# EAGLE design Base_board_V1 (EAGLE 9.6.2)
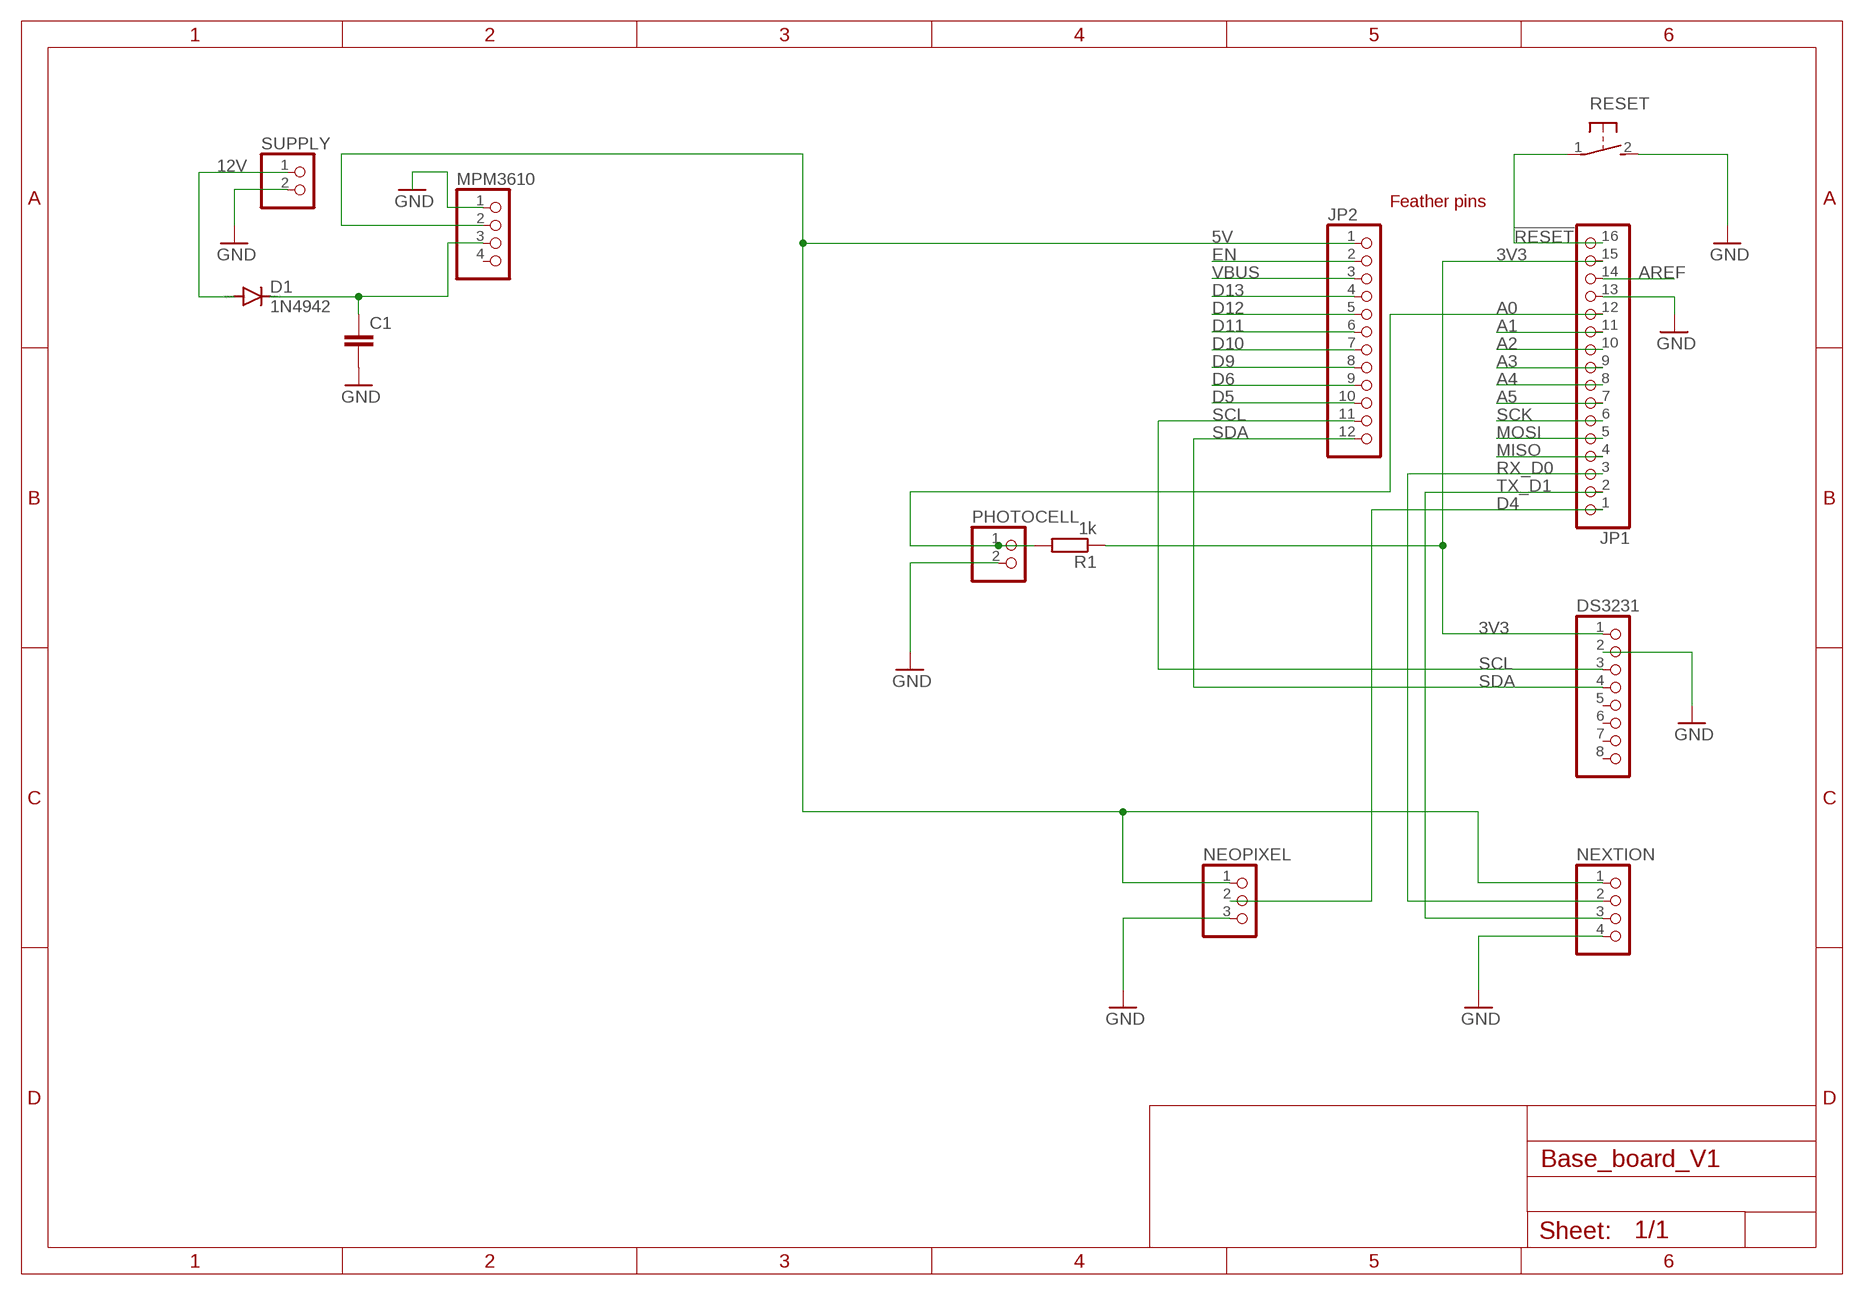
[diagram p0: schematic, sheet 1]

## Parts
C1  C2,5-3  [C2.5-3]
D1  1N4942  [DO41-10]
DS3231  HEADER-1X870MIL  [1X08_ROUND_70]
JP1  HEADER-1X16ROUND  [1X16_ROUND]
JP2  HEADER-1X12  [1X12_ROUND]
MPM3610  PINHD-1X4  [1X04]
NEOPIXEL  PINHD-1X3/90  [1X03/90]
NEXTION  PINHD-1X4  [1X04]
PHOTOCELL  PINHD-1X2/90  [1X02/90]
R1  1k  R-EU_0207/10  [0207/10]
RESET  31-XX  [B3F-31XX]
SUPPLY  PINHD-1X2  [1X02]

## Nets
3V3 [power]: DS3231.1 JP1.15 R1.1
5V: JP2.1 MPM3610.2 NEOPIXEL.1 NEXTION.1
12V: D1.A SUPPLY.1
!RESET: JP1.16 RESET.1(P)
A0: JP1.12 PHOTOCELL.1 R1.2
A1: JP1.11
A2: JP1.10
A3: JP1.9
A4: JP1.8
A5: JP1.7
AREF: JP1.14
D4: JP1.1 NEOPIXEL.2
D5: JP2.10
D6: JP2.9
D9: JP2.8
D10: JP2.7
D11: JP2.6
D12: JP2.5
D13: JP2.4
EN: JP2.2
GND [power]: C1.2 DS3231.2 JP1.13 MPM3610.1 NEOPIXEL.3 NEXTION.4 PHOTOCELL.2 RESET.2(S) SUPPLY.2
MISO: JP1.4
MOSI: JP1.5
N$1: C1.1 D1.C MPM3610.3
RX_D0: JP1.3 NEXTION.2
SCK: JP1.6
SCL: DS3231.3 JP2.11
SDA: DS3231.4 JP2.12
TX_D1: JP1.2 NEXTION.3
VBUS [power]: JP2.3
Unconnected: DS3231.5 DS3231.6 DS3231.7 DS3231.8 MPM3610.4

## Notes on the sheet
- Feather pins

## Library data of the parts
C1 = capacitor-wima:C: CAPACITOR naming: grid - package width
D1 = diode:1N4942: DIODE 1.0 A, 200 V, 150 ns
DS3231 = microbuilder:HEADER-1X8: PIN HEADER
JP1 = microbuilder:HEADER-1X16: PIN HEADER
JP2 = microbuilder:HEADER-1X12
MPM3610 NEXTION = pinhead:PINHD-1X4: PIN HEADER
NEOPIXEL = pinhead:PINHD-1X3: PIN HEADER
PHOTOCELL SUPPLY = pinhead:PINHD-1X2: PIN HEADER
R1 = rcl:R-EU_: RESISTOR, European symbol; SPICEPREFIX: R
RESET = switch-omron:31-XX: OMRON SWITCH; MPN: B3F-3100; OC_FARNELL: 959704; OC_NEWARK: 36M3582

## Net classes
1 power: width 0.305 mm

## Board
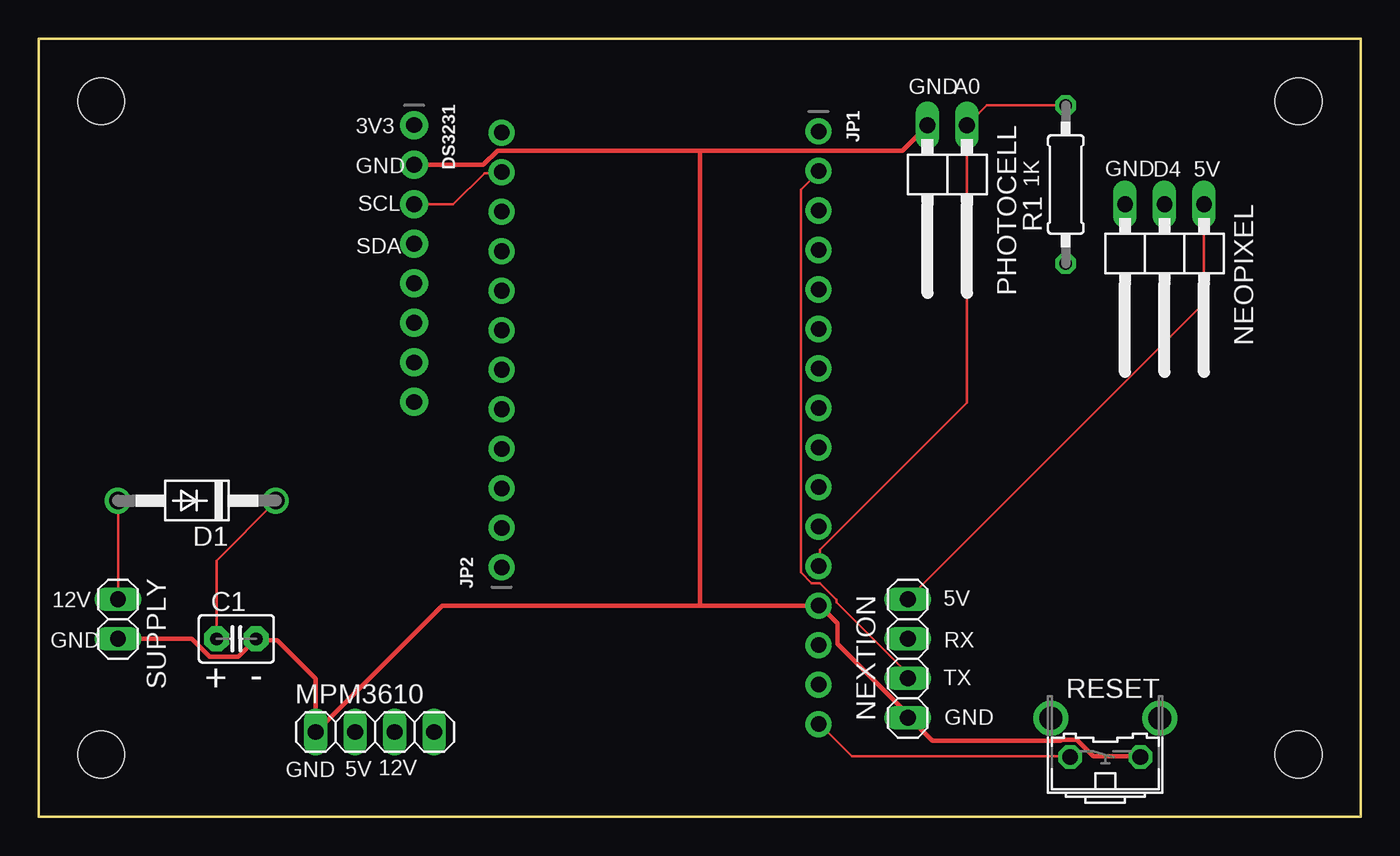
[diagram p1: board, top side]
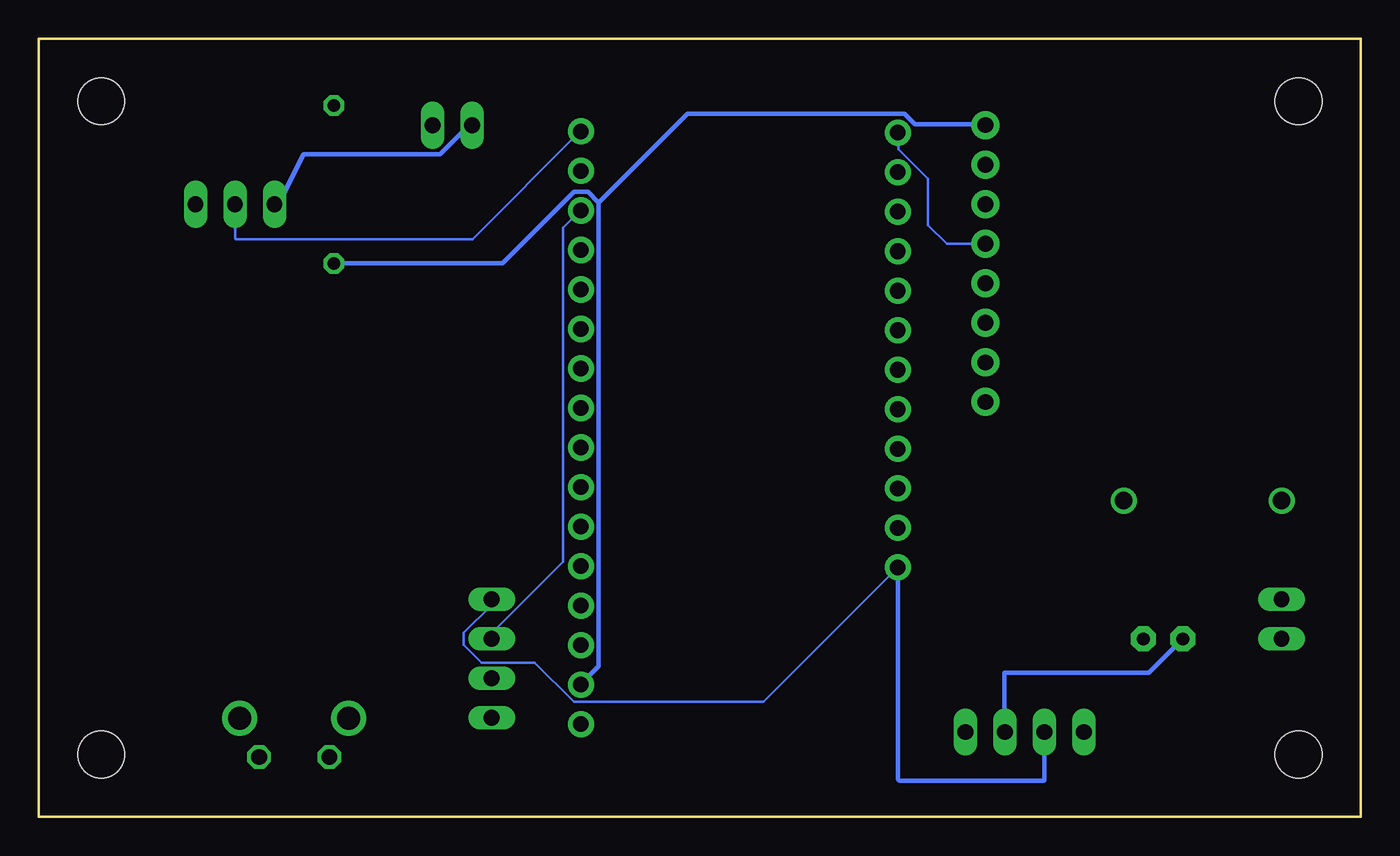
[diagram p2: board, bottom side, seen from below]

Size 85 x 50 mm. Coordinates in mm from the lower left corner, seen from the top.
Outline: 0,0 0,50 85,50 85,0 0,0
Copper layers (1*16): Top 0.035mm / dielectric 1.5mm / Bottom 0.035mm
Design rules "default": minimum track width 6mil, minimum drill 0.35mm, track to track 6mil, track to pad 6mil, pad to pad 6mil, via to via 6mil, smd to smd 6mil, copper to edge 40mil, drill to drill 6mil, minimum pad ring 10mil, minimum via ring 8mil, stop-mask expansion 4mil, vias tented up to drill 0mil, thermal gap 10mil
Holes 3 mm at 4,46 4,4 81,4 81,46

### Footprints (pad centres in the part's own frame; a part is rotated, then mirrored left to right if it is on the bottom)
C2.5-3 = drill 0.813 pad 1.6 octagon: 1 -1.27,0; 2 1.27,0
DO41-10 = drill 1.118: A 5.08,0; C -5.08,0
1X08_ROUND_70 = drill 1 pad 1.778: 1 -8.89,0; 2 -6.35,0; 3 -3.81,0; 4 -1.27,0; 5 1.27,0; 6 3.81,0; 7 6.35,0; 8 8.89,0
1X16_ROUND = drill 1 pad 1.676: 1 -19.05,0; 2 -16.51,0; 3 -13.97,0; 4 -11.43,0; 5 -8.89,0; 6 -6.35,0; 7 -3.81,0; 8 -1.27,0; 9 1.27,0; 10 3.81,0; 11 6.35,0; 12 8.89,0; 13 11.43,0; 14 13.97,0; 15 16.51,0; 16 19.05,0
1X12_ROUND = drill 1 pad 1.676: 1 -13.97,0; 2 -11.43,0; 3 -8.89,0; 4 -6.35,0; 5 -3.81,0; 6 -1.27,0; 7 1.27,0; 8 3.81,0; 9 6.35,0; 10 8.89,0; 11 11.43,0; 12 13.97,0
1X04 = drill 1.016 long: 1 -3.81,0; 2 -1.27,0; 3 1.27,0; 4 3.81,0
1X03/90 = drill 1.016 long: 1 -2.54,-3.81; 2 0,-3.81; 3 2.54,-3.81
1X02/90 = drill 1.016 long: 1 -1.27,-3.81; 2 1.27,-3.81
0207/10 = drill 0.813 octagon: 1 -5.08,0; 2 5.08,0
B3F-31XX = drill 1.016 octagon: 1 -2.261,-1.245; 2 2.261,-1.245 | drill 1.499 pad 2.159: 3 -3.505,1.245; 4 3.505,1.245
1X02 = drill 1.016 long: 1 -1.27,0; 2 1.27,0

### Placement (x,y rotation side)
C1  12.7,11.43 0 top
D1  10.16,20.32 180 top
DS3231  24.13,35.56 270 top
JP1  50.14,25 270 top
JP2  29.76,30 90 top
MPM3610  21.61,5.44 0 top
NEOPIXEL  72.39,35.56 180 top
NEXTION  55.88,10.16 270 top
PHOTOCELL  58.42,40.64 180 top
R1  66.04,40.64 90 top
RESET  68.58,5.08 0 top
SUPPLY  5.08,12.7 270 top

### Tracks (layer width: path | path; a pad name or v marks a point on that pad's centre or on a via)
3V3
  Bottom 0.305: JP1.15 50.14,8.53 49,9.68 49,39.47 | 49,39.47 49.68,40.16 50.6,40.16 55.17,35.59 66.02,35.59 R1.1 | 49,39.47 43.28,45.19 29.34,45.19 28.65,44.5 24.13,44.5 DS3231.1
5V
  Top 0.152: NEXTION.1 74.91,32.99 74.91,39.34 NEOPIXEL.1
  Bottom 0.152: NEXTION.1 55.93,13.95 55.93,13.56 57.68,11.81 57.68,11.05 56.54,9.91 53.11,9.91 50.6,7.39 38.41,7.39 29.79,16 JP2.1
  Bottom 0.305: MPM3610.2 20.34,2.33 20.36,2.31 29.67,2.31 29.76,2.4 JP2.1
12V
  Top 0.152: SUPPLY.1 5.11,14.02 5.11,20.27 D1.A
!RESET
  Top 0.152: RESET.1 66.29,3.89 52.27,3.89 50.22,5.94 JP1.16
A0
  Top 0.152: R1.2 60.96,45.72 PHOTOCELL.1 59.66,44.42 59.66,26.59 50.22,17.14 50.22,16.15 JP1.12
D4
  Bottom 0.152: JP1.1 50.22,44.04 57.12,37.13 72.34,37.13 72.39,37.19 NEOPIXEL.2
GND
  Top 0.305: DS3231.2 28.57,41.91 29.49,42.82 42.52,42.82 | 42.52,42.82 55.55,42.82 57.15,44.42 PHOTOCELL.2 | SUPPLY.2 9.83,11.43 10.97,10.29 12.8,10.29 13.95,11.43 C1.2 14.1,11.35 15.32,11.35 17.8,8.87 MPM3610.1 25.92,13.56 42.52,13.56 | RESET.2 70.79,3.89 67.82,3.89 66.75,4.95 65.76,4.95 65.68,4.88 57.45,4.88 56.01,6.33 NEXTION.4 55.85,6.4 55.85,6.63 51.36,11.12 51.36,12.42 50.22,13.56 JP1.13 49.99,13.56 42.52,13.56 | 42.52,13.56 42.52,42.82
  Bottom 0.305: PHOTOCELL.2 57.15,44.42 57.38,44.42 59.21,42.6 67.97,42.6 69.32,39.9 NEOPIXEL.3
N$1
  Top 0.152: C1.1 11.43,16.46 15.24,20.27 D1.C
  Bottom 0.305: C1.1 13.61,9.25 22.91,9.25 22.91,5.47 MPM3610.3
RX_D0
  Bottom 0.152: NEXTION.2 55.85,11.43 55.85,11.81 51.28,16.38 51.28,37.87 50.22,38.94 JP1.3
SCL
  Top 0.152: JP2.11 29.72,41.38 28.65,41.38 26.64,39.37 DS3231.3
SDA
  Bottom 0.152: JP2.12 29.72,43.97 29.72,42.9 27.81,41 27.81,38.02 26.62,36.83 DS3231.4
TX_D1
  Top 0.152: NEXTION.3 55.85,8.91 55.85,9.22 51.28,13.79 51.28,13.95 50.22,15.01 49.68,15.01 49,15.7 49,40.31 50.14,41.45 JP1.2

### Text on the board
tNames: GND | A0 | 3V3 | GND | GND | D4 | 5V | 1K | SCL | SDA | 5V | 12V | GND | RX | + | - | TX | GND | GND | 5V | 12V